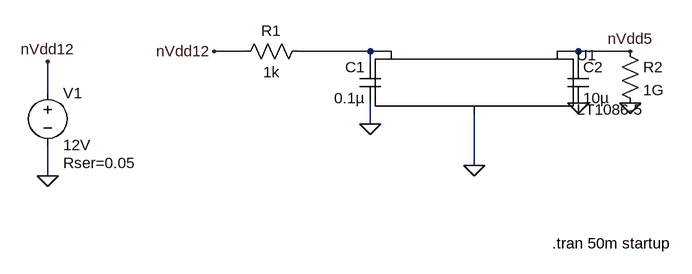
[diagram p0: schematic Rail5V.asc]
Rail5V.asc, the LTspice schematic file:
Version 4
SHEET 1 1144 680
WIRE 368 112 320 112
WIRE 560 112 448 112
WIRE 592 112 560 112
WIRE 880 112 848 112
WIRE 960 112 880 112
WIRE 560 128 560 112
WIRE 880 128 880 112
WIRE 64 176 64 128
WIRE 560 224 560 192
WIRE 720 288 720 208
WIRE 64 304 64 256
FLAG 64 304 0
FLAG 64 128 nVdd12
FLAG 720 288 0
FLAG 320 112 nVdd12
FLAG 560 224 0
FLAG 960 112 nVdd5
FLAG 880 192 0
FLAG 960 192 0
SYMBOL voltage 64 160 R0
WINDOW 123 0 0 Left 0
WINDOW 39 24 124 Left 2
SYMATTR SpiceLine Rser=0.05
SYMATTR InstName V1
SYMATTR Value 12V
SYMBOL PowerProducts\\LT1086-5 720 112 R0
SYMATTR InstName U1
SYMBOL cap 576 192 R180
WINDOW 0 24 56 Left 2
WINDOW 3 24 8 Left 2
SYMATTR InstName C1
SYMATTR Value 0.1µ
SYMATTR SpiceLine V=16 Irms=0.6 Rser=0.05 Lser=250p
SYMBOL cap 864 128 R0
SYMATTR InstName C2
SYMATTR Value 10µ
SYMATTR SpiceLine V=10 Irms=1.25 Rser=5m Lser=500p
SYMBOL res 464 96 R90
WINDOW 0 0 56 VBottom 2
WINDOW 3 32 56 VTop 2
SYMATTR InstName R1
SYMATTR Value 1k
SYMBOL res 944 96 R0
SYMATTR InstName R2
SYMATTR Value 1G
TEXT 840 408 Left 2 !.tran 50m startup

The netlist it stands for:
* Rail5V.asc
V1 nVdd12 0 12V Rser=0.05
XU1 0 nVdd5 N001 LT1086-5
C1 0 N001 0.1µ V=16 Irms=0.6 Rser=0.05 Lser=250p
C2 nVdd5 0 10µ V=10 Irms=1.25 Rser=5m Lser=500p
R1 N001 nVdd12 1k
R2 nVdd5 0 1G
.tran 50m startup
.backanno
.end